# Altium project Banker_VHDCI_2_EDGE _BUF.PrjPCB
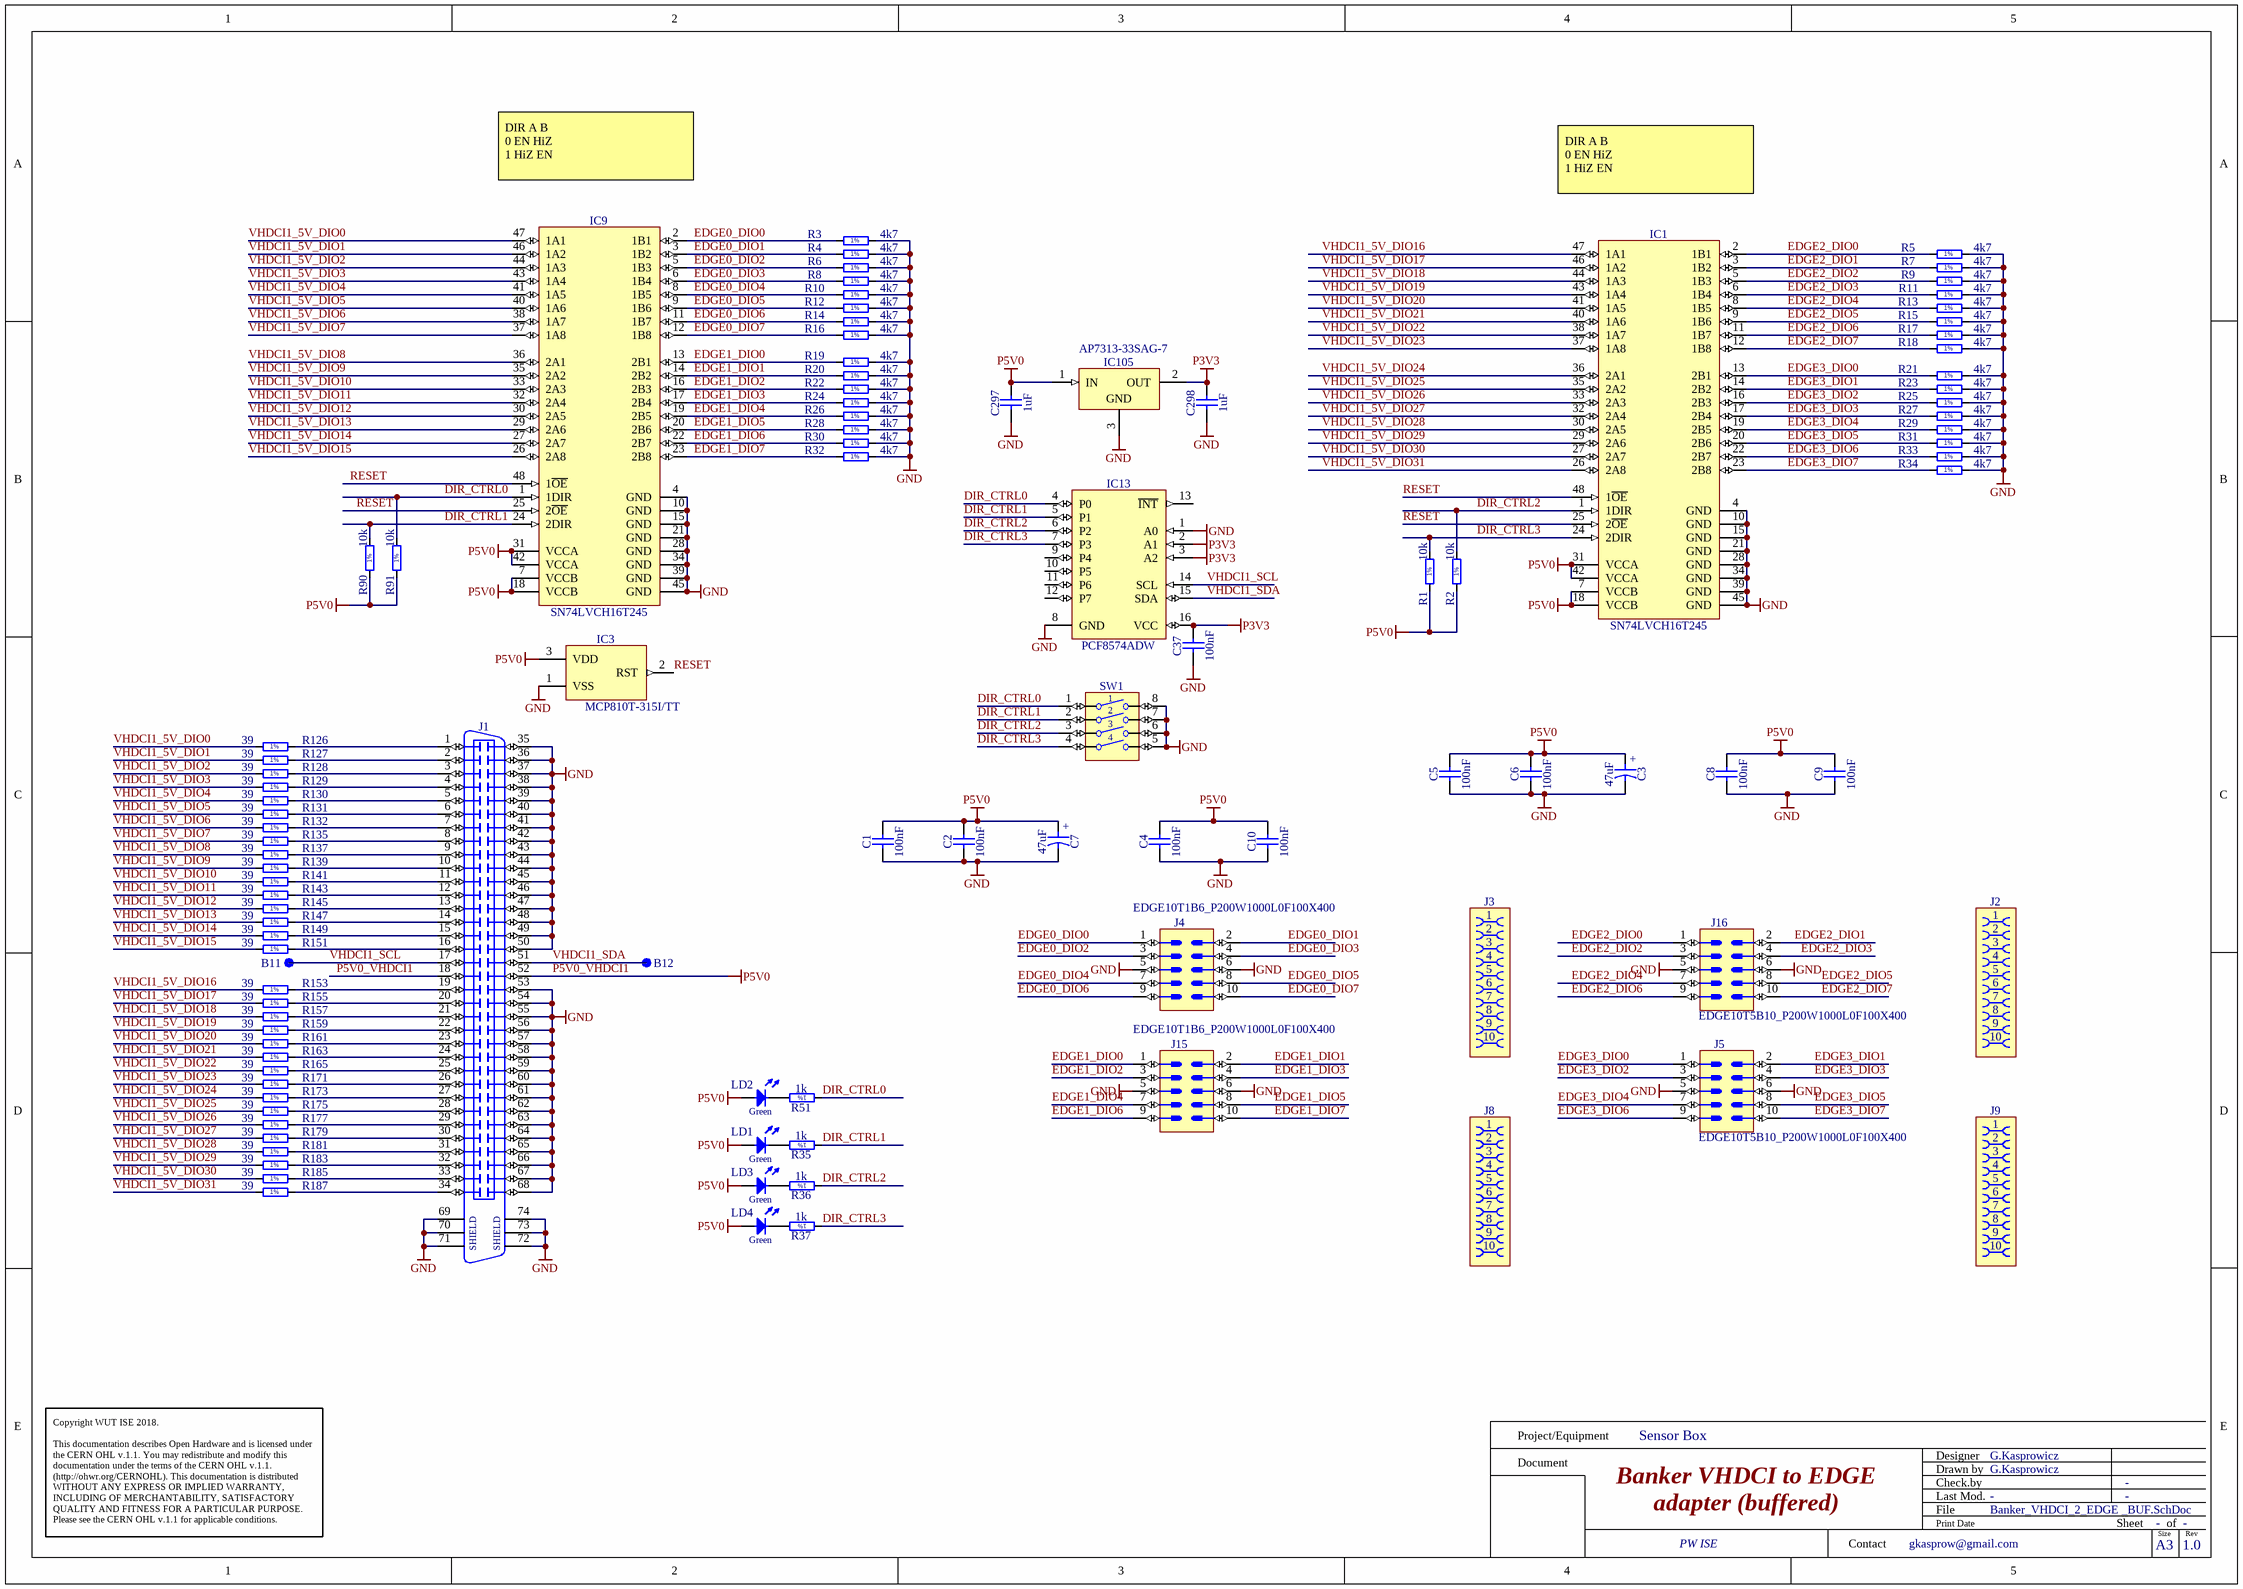
[diagram p0: Banker_VHDCI_2_EDGE _BUF.SchDoc]
1 sheet, 106 parts. Net scope: global (net labels, ports and power ports of the same name join across sheets).
Board file: Banker_VHDCI_2_EDGE _BUF.PCBDOC

## Sheet Banker_VHDCI_2_EDGE _BUF.SchDoc: Banker VHDCI to EDGE
size 420 x 297 mm; Author: G.Kasprowicz; CompanyName: WUT ISE; DrawnBy: G.Kasprowicz; Organization: WUT ISE; Address1: PW ISE; Address2: Nowowiejska 15/19 00-665 Warsaw; Address3: gkasprow@gmail.com; Revision: 1.0; SheetNumber: -; SheetTotal: -; ModifiedBy: -; CheckedDate: -; Title2: adapter (buffered); DivGrp: WUT ISE; Designer: G.Kasprowicz; ModifiedDate: -; ProjectName: Sensor Box

### Parts
B11  SMD Pad  [C100]  (value not drawn)
B12  SMD Pad  [C100]  (value not drawn)
C1  100nF  [CAPC1005X55N]
C2  100nF  [CAPC1005X55N]
C3  47uF  [CAPMP7343X310N]
C4  100nF  [CAPC1005X55N]
C5  100nF  [CAPC1005X55N]
C6  100nF  [CAPC1005X55N]
C7  47uF  [CAPMP7343X310N]
C8  100nF  [CAPC1005X55N]
C9  100nF  [CAPC1005X55N]
C10  100nF  [CAPC1005X55N]
C37  100nF  [CAPC1005X55N]
C297  1uF  [CAPC1005X55N]
C298  1uF  [CAPC1005X55N]
IC1  SN74LVCH16T245  [SOP50P810X120-48N]
IC3  MCP810T-315I/TT  [SOT95P237X112-3N]
IC9  SN74LVCH16T245  [SOP50P810X120-48N]
IC13  PCF8574ADW  [SOIC127P1030X265-16N]
IC105  AP7313-33SAG-7  [SOT95P240X130-3N]
J1  VHDCI  [MOLEX_73776-0201]  (value not drawn)
J2  (no value)  [AVX_00 9159 010 061 916]
J3  (no value)  [AVX_00 9159 010 061 916]
J4  (no value)  [EDGE10T1B6_P200W1000L0F100X400]
J5  (no value)  [EDGE10T5B10_P200W1000L0F100X400]
J8  (no value)  [AVX_00 9159 010 061 916]
J9  (no value)  [AVX_00 9159 010 061 916]
J15  (no value)  [EDGE10T1B6_P200W1000L0F100X400]
J16  (no value)  [EDGE10T5B10_P200W1000L0F100X400]
LD1  Green  [LED_KINGBRIGHT_KPTR3216]  (value not drawn)
LD2  Green  [LED_KINGBRIGHT_KPTR3216]  (value not drawn)
LD3  Green  [LED_KINGBRIGHT_KPTR3216]  (value not drawn)
LD4  Green  [LED_KINGBRIGHT_KPTR3216]  (value not drawn)
R1  10k  [RESC1005X40N]
R2  10k  [RESC1005X40N]
R3  4k7  [RESC1005X40N]
R4  4k7  [RESC1005X40N]
R5  4k7  [RESC1005X40N]
R6  4k7  [RESC1005X40N]
R7  4k7  [RESC1005X40N]
R8  4k7  [RESC1005X40N]
R9  4k7  [RESC1005X40N]
R10  4k7  [RESC1005X40N]
R11  4k7  [RESC1005X40N]
R12  4k7  [RESC1005X40N]
R13  4k7  [RESC1005X40N]
R14  4k7  [RESC1005X40N]
R15  4k7  [RESC1005X40N]
R16  4k7  [RESC1005X40N]
R17  4k7  [RESC1005X40N]
R18  4k7  [RESC1005X40N]
R19  4k7  [RESC1005X40N]
R20  4k7  [RESC1005X40N]
R21  4k7  [RESC1005X40N]
R22  4k7  [RESC1005X40N]
R23  4k7  [RESC1005X40N]
R24  4k7  [RESC1005X40N]
R25  4k7  [RESC1005X40N]
R26  4k7  [RESC1005X40N]
R27  4k7  [RESC1005X40N]
R28  4k7  [RESC1005X40N]
R29  4k7  [RESC1005X40N]
R30  4k7  [RESC1005X40N]
R31  4k7  [RESC1005X40N]
R32  4k7  [RESC1005X40N]
R33  4k7  [RESC1005X40N]
R34  4k7  [RESC1005X40N]
R35  1k  [RESC1005X40N]
R36  1k  [RESC1005X40N]
R37  1k  [RESC1005X40N]
R51  1k  [RESC1005X40N]
R90  10k  [RESC1005X40N]
R91  10k  [RESC1005X40N]
R126  39  [RESC2012X60N]
R127  39  [RESC2012X60N]
R128  39  [RESC2012X60N]
R129  39  [RESC2012X60N]
R130  39  [RESC2012X60N]
R131  39  [RESC2012X60N]
R132  39  [RESC2012X60N]
R135  39  [RESC2012X60N]
R137  39  [RESC2012X60N]
R139  39  [RESC2012X60N]
R141  39  [RESC2012X60N]
R143  39  [RESC2012X60N]
R145  39  [RESC2012X60N]
R147  39  [RESC2012X60N]
R149  39  [RESC2012X60N]
R151  39  [RESC2012X60N]
R153  39  [RESC2012X60N]
R155  39  [RESC2012X60N]
R157  39  [RESC2012X60N]
R159  39  [RESC2012X60N]
R161  39  [RESC2012X60N]
R163  39  [RESC2012X60N]
R165  39  [RESC2012X60N]
R171  39  [RESC2012X60N]
R173  39  [RESC2012X60N]
R175  39  [RESC2012X60N]
R177  39  [RESC2012X60N]
R179  39  [RESC2012X60N]
R181  39  [RESC2012X60N]
R183  39  [RESC2012X60N]
R185  39  [RESC2012X60N]
R187  39  [RESC2012X60N]
SW1  Switch  [SW_OMRON_A6S-4102-H]  (value not drawn)

### Nets
GND: C1.1 C2.1 C3.2 C4.1 C5.1 C6.1 C7.2 C8.1 C9.1 C10.1 C37.1 C297.1 C298.1 IC1.4(GND) IC1.10(GND) IC1.15(GND) IC1.21(GND) IC1.28(GND) IC1.34(GND) IC1.39(GND) IC1.45(GND) IC3.1(VSS) IC9.4(GND) IC9.10(GND) IC9.15(GND) IC9.21(GND) IC9.28(GND) IC9.34(GND) IC9.39(GND) IC9.45(GND) IC13.1(A0) IC13.8(GND) IC105.3(GND) J1.35 J1.36 J1.37 J1.38 J1.39 J1.40 J1.41 J1.42 J1.43 J1.44 J1.45 J1.46 J1.47 J1.48 J1.49 J1.50 J1.53 J1.54 J1.55 J1.56 J1.57 J1.58 J1.59 J1.60 J1.61 J1.62 J1.63 J1.64 J1.65 J1.66 J1.67 J1.68 J1.69 J1.70 J1.71 J1.72 J1.73 J1.74 J4.5 J4.6 J5.5 J5.6 J15.5 J15.6 J16.5 J16.6 R3.2 R4.2 R5.2 R6.2 R7.2 R8.2 R9.2 R10.2 R11.2 R12.2 R13.2 R14.2 R15.2 R16.2 R17.2 R18.2 R19.2 R20.2 R21.2 R22.2 R23.2 R24.2 R25.2 R26.2 R27.2 R28.2 R29.2 R30.2 R31.2 R32.2 R33.2 R34.2 SW1.5 SW1.6 SW1.7 SW1.8
P3V3: C37.2 C298.2 IC13.2(A1) IC13.3(A2) IC13.16(VCC) IC105.2(OUT)
P5V0_VHDCI1: C1.2 C2.2 C3.1 C4.2 C5.2 C6.2 C7.1 C8.2 C9.2 C10.2 C297.2 IC1.7(VCCB) IC1.18(VCCB) IC1.31(VCCA) IC1.42(VCCA) IC3.3(VDD) IC9.7(VCCB) IC9.18(VCCB) IC9.31(VCCA) IC9.42(VCCA) IC105.1(IN) J1.18 J1.52 LD1.2(A) LD2.2(A) LD3.2(A) LD4.2(A) R1.1 R2.1 R90.1 R91.1  [also labelled P5V0]
DIR_CTRL0: IC9.1(1DIR) IC13.4(P0) R51.1 R91.2 SW1.1
DIR_CTRL1: IC9.24(2DIR) IC13.5(P1) R35.1 R90.2 SW1.2
DIR_CTRL2: IC1.1(1DIR) IC13.6(P2) R2.2 R36.1 SW1.3
DIR_CTRL3: IC1.24(2DIR) IC13.7(P3) R1.2 R37.1 SW1.4
EDGE0_DIO0: IC9.2(1B1) J4.1 R3.1
EDGE0_DIO1: IC9.3(1B2) J4.2 R4.1
EDGE0_DIO2: IC9.5(1B3) J4.3 R6.1
EDGE0_DIO3: IC9.6(1B4) J4.4 R8.1
EDGE0_DIO4: IC9.8(1B5) J4.7 R10.1
EDGE0_DIO5: IC9.9(1B6) J4.8 R12.1
EDGE0_DIO6: IC9.11(1B7) J4.9 R14.1
EDGE0_DIO7: IC9.12(1B8) J4.10 R16.1
EDGE1_DIO0: IC9.13(2B1) J15.1 R19.1
EDGE1_DIO1: IC9.14(2B2) J15.2 R20.1
EDGE1_DIO2: IC9.16(2B3) J15.3 R22.1
EDGE1_DIO3: IC9.17(2B4) J15.4 R24.1
EDGE1_DIO4: IC9.19(2B5) J15.7 R26.1
EDGE1_DIO5: IC9.20(2B6) J15.8 R28.1
EDGE1_DIO6: IC9.22(2B7) J15.9 R30.1
EDGE1_DIO7: IC9.23(2B8) J15.10 R32.1
EDGE2_DIO0: IC1.2(1B1) J16.1 R5.1
EDGE2_DIO1: IC1.3(1B2) J16.2 R7.1
EDGE2_DIO2: IC1.5(1B3) J16.3 R9.1
EDGE2_DIO3: IC1.6(1B4) J16.4 R11.1
EDGE2_DIO4: IC1.8(1B5) J16.7 R13.1
EDGE2_DIO5: IC1.9(1B6) J16.8 R15.1
EDGE2_DIO6: IC1.11(1B7) J16.9 R17.1
EDGE2_DIO7: IC1.12(1B8) J16.10 R18.1
EDGE3_DIO0: IC1.13(2B1) J5.1 R21.1
EDGE3_DIO1: IC1.14(2B2) J5.2 R23.1
EDGE3_DIO2: IC1.16(2B3) J5.3 R25.1
EDGE3_DIO3: IC1.17(2B4) J5.4 R27.1
EDGE3_DIO4: IC1.19(2B5) J5.7 R29.1
EDGE3_DIO5: IC1.20(2B6) J5.8 R31.1
EDGE3_DIO6: IC1.22(2B7) J5.9 R33.1
EDGE3_DIO7: IC1.23(2B8) J5.10 R34.1
RESET: IC1.25(2~{OE}) IC1.48(1~{OE}) IC3.2(RST) IC9.25(2~{OE}) IC9.48(1~{OE})
VHDCI1_5V_DIO0: IC9.47(1A1) R126.1
VHDCI1_5V_DIO1: IC9.46(1A2) R127.1
VHDCI1_5V_DIO2: IC9.44(1A3) R128.1
VHDCI1_5V_DIO3: IC9.43(1A4) R129.1
VHDCI1_5V_DIO4: IC9.41(1A5) R130.1
VHDCI1_5V_DIO5: IC9.40(1A6) R131.1
VHDCI1_5V_DIO6: IC9.38(1A7) R132.1
VHDCI1_5V_DIO7: IC9.37(1A8) R135.1
VHDCI1_5V_DIO8: IC9.36(2A1) R137.1
VHDCI1_5V_DIO9: IC9.35(2A2) R139.1
VHDCI1_5V_DIO10: IC9.33(2A3) R141.1
VHDCI1_5V_DIO11: IC9.32(2A4) R143.1
VHDCI1_5V_DIO12: IC9.30(2A5) R145.1
VHDCI1_5V_DIO13: IC9.29(2A6) R147.1
VHDCI1_5V_DIO14: IC9.27(2A7) R149.1
VHDCI1_5V_DIO15: IC9.26(2A8) R151.1
VHDCI1_5V_DIO16: IC1.47(1A1) R153.1
VHDCI1_5V_DIO17: IC1.46(1A2) R155.1
VHDCI1_5V_DIO18: IC1.44(1A3) R157.1
VHDCI1_5V_DIO19: IC1.43(1A4) R159.1
VHDCI1_5V_DIO20: IC1.41(1A5) R161.1
VHDCI1_5V_DIO21: IC1.40(1A6) R163.1
VHDCI1_5V_DIO22: IC1.38(1A7) R165.1
VHDCI1_5V_DIO23: IC1.37(1A8) R171.1
VHDCI1_5V_DIO24: IC1.36(2A1) R173.1
VHDCI1_5V_DIO25: IC1.35(2A2) R175.1
VHDCI1_5V_DIO26: IC1.33(2A3) R177.1
VHDCI1_5V_DIO27: IC1.32(2A4) R179.1
VHDCI1_5V_DIO28: IC1.30(2A5) R181.1
VHDCI1_5V_DIO29: IC1.29(2A6) R183.1
VHDCI1_5V_DIO30: IC1.27(2A7) R185.1
VHDCI1_5V_DIO31: IC1.26(2A8) R187.1
VHDCI1_SCL: B11.1 IC13.14(SCL) J1.17
VHDCI1_SDA: B12.1 IC13.15(SDA) J1.51
NetJ1_1: J1.1 R126.2
NetJ1_2: J1.2 R127.2
NetJ1_3: J1.3 R128.2
NetJ1_4: J1.4 R129.2
NetJ1_5: J1.5 R130.2
NetJ1_6: J1.6 R131.2
NetJ1_7: J1.7 R132.2
NetJ1_8: J1.8 R135.2
NetJ1_9: J1.9 R137.2
NetJ1_10: J1.10 R139.2
NetJ1_11: J1.11 R141.2
NetJ1_12: J1.12 R143.2
NetJ1_13: J1.13 R145.2
NetJ1_14: J1.14 R147.2
NetJ1_15: J1.15 R149.2
NetJ1_16: J1.16 R151.2
NetJ1_19: J1.19 R153.2
NetJ1_20: J1.20 R155.2
NetJ1_21: J1.21 R157.2
NetJ1_22: J1.22 R159.2
NetJ1_23: J1.23 R161.2
NetJ1_24: J1.24 R163.2
NetJ1_25: J1.25 R165.2
NetJ1_26: J1.26 R171.2
NetJ1_27: J1.27 R173.2
NetJ1_28: J1.28 R175.2
NetJ1_29: J1.29 R177.2
NetJ1_30: J1.30 R179.2
NetJ1_31: J1.31 R181.2
NetJ1_32: J1.32 R183.2
NetJ1_33: J1.33 R185.2
NetJ1_34: J1.34 R187.2
NetLD1_1: LD1.1(C) R35.2
NetLD2_1: LD2.1(C) R51.2
NetLD3_1: LD3.1(C) R36.2
NetLD4_1: LD4.1(C) R37.2

Not connected (* = marked no-connect by the designer): IC13 9(P4) 10(P5) 11(P6) 12(P7) 13(~{INT})

### Notes on the sheet
- DIR	A	B
  0	EN	HiZ
  1	HiZ	EN
- Project/Equipment
- Document
- Designer
- Drawn by
- Check.by
- Copyright WUT ISE 2018.
  This documentation describes Open Hardware and is licensed under the CERN OHL v.1.1. You may redistribute and modify this documentation under the terms of the CERN OHL v.1.1. (http://ohwr.org/CERNOHL). This documentation is distributed WITHOUT ANY EXPRESS OR IMPLIED WARRANTY, INCLUDING OF MERCHANTABILITY, SATISFACTORY QUALITY AND FITNESS FOR A PARTICULAR PURPOSE. Please see the CERN OHL v.1.1 for applicable conditions.
- Contact
- File
- Last Mod.
- Print Date
- Sheet
- Size
- A3
- of
- Rev
- (in symbol CTE7343-31_47UF_25V_10%) +
- (in symbol MOLEX_73776-0201) SHIELD
- (in symbol R0402_1K_1%_0.0625W_100PPM) 1%
- (in symbol R0402_4K7_1%_0.0625W_100PPM) 1%
- (in symbol R0402_10K_1%_0.0625W_100PPM) 1%
- (in symbol R0805_39R_1%_0.125W_100PPM) 1%

### Library data of the parts
B11 B12 = SMD_PAD_D1MM: Through Hole Pad; Part Description: 1mm Diameter SMD Pad; Mounted: No; Part Number: SMD_PAD_D1MM; Component Kind: Standard (No BOM); Component Type: Standard (No BOM); Pin Count: 1; Family: SMD Pad; Socket: No; SMD: No; Sense: No; Status: None; ComponentHeight: 0mm; HelpURL: Undefined; Author: CERN DEM JLC; CreateDate: 10.10.2017; LatestRevisionDate: 10.10.2017; PackageDescription: 1mm Diameter SMD Pad
C1 C2 C4-C6 C8-C10 C37 = CC0402_100NF_16V_10%_X5R: Non-polarised capacitor; Part Description: SMD Multilayer Chip Ceramic Capacitor; Manufacturer: GENERIC; Manufacturer1 Part Number: GRM155R61C104KA88D; Voltage: 16V; TC: X5R; Tolerance: ±10%; Part Number: CC0402_100NF_16V_10%_X5R; Component Kind: Standard; Component Type: Standard; Pin Count: 2; Value: 100nF; Status: None; Manufacturer Part Number: CC0402_100NF_16V_10%_X5R; Case: 0402; Mounted: Yes; Socket: No; SMD: Yes; Sense: No; Manufacturer1 Example: MURATA; Manufacturer1 ComponentHeight: 0.55mm; HelpURL: \\cern.ch\dfs\Applications\Altium\Datasheets\CC0402_X5R_MURATA_GRM.pdf; Author: CERN DEM JLC; CreateDate: 10.12.2013; LatestRevisionDate: 10.12.2013
C3 C7 = CTE7343-31_47UF_25V_10%: Polarised capacitor; Part Description: Solid Tantalum Chip Capacitor; Manufacturer: GENERIC; Manufacturer1 Part Number: TAJD476K025R; Voltage: 25V; Tolerance: ±10%; Part Number: CTE7343-31_47UF_25V_10%; Component Kind: Standard; Component Type: Standard; Pin Count: 2; Value: 47uF; Status: Preferred; Manufacturer Part Number: CTE7343-31_47UF_25V_10%; Case: D; Mounted: Yes; Socket: No; SMD: Yes; Sense: No; Manufacturer1 Example: AVX; Manufacturer1 ComponentHeight: 3.1mm; HelpURL: \\cern.ch\dfs\Applications\Altium\Datasheets\CTE_AVX_TAJ.pdf; Author: CERN DEM JLC; CreateDate: 03/12/2007; LatestRevisionDate: 03/12/2007
C297 C298 = CC0402_1UF_16V_10%_X5R: Non-polarised capacitor; Part Description: SMD Multilayer Chip Ceramic Capacitor; Manufacturer: GENERIC; Manufacturer1 Part Number: C1005X5R1C105KT; Voltage: 16V; TC: X5R; Tolerance: ±10%; Part Number: CC0402_1UF_16V_10%_X5R; Component Kind: Standard; Component Type: Standard; Pin Count: 2; Value: 1uF; Status: Preferred; Manufacturer Part Number: CC0402_1UF_16V_10%_X5R; Case: 0402; Mounted: Yes; Socket: No; SMD: Yes; Sense: No; Manufacturer1 Example: TDK; Manufacturer1 ComponentHeight: 0.55mm; HelpURL: \\cern.ch\dfs\Applications\Altium\Datasheets\CC0402_X5R_TDK_C.pdf; Author: CERN DEM JLC; CreateDate: 25.10.2012; LatestRevisionDate: 25.10.2012
IC1 IC9 = 74LVCH16T245: 16-Bit Dual-Supply Bus Transceiver With Configurable Voltage Translation And 3-State Outputs; Part Number: SN74LVCH16T245DGGR; Part Description: 16-Bit Dual-Supply Bus Transceivers With Configurable Voltage Translation And 3-State Outputs; Manufacturer: TEXAS INSTRUMENTS; PressFit: No; Bonding: No; Component Kind: Standard; Component Type: Standard; Device: SN74LVCH16T245; PackageDescription: SOP, 48-Leads, Body 12.6x6.2mm (max), Pitch 0.50mm, IPC Medium Density; Manufacturer Part Number: SN74LVCH16T245DGGR; Pin Count: 48; Case: TSSOP48; Mounted: Yes; Socket: No; SMD: Yes; Sense: No; ComponentHeight: 1.2mm; Author: GK; HelpURL: \\cern.ch\dfs\Applications\Altium\Datasheets\CLVCH16T245MDGGREP.pdf; CreateDate: 09/02/2016; LatestRevisionDate: 09/02/2016
IC3 = VMON_MCP810: 3.075V Microcontroller Supervisory Circuit With Push-Pull Output; Manufacturer: MICROCHIP TECHNOLOGY; PressFit: No; Bonding: No; Part Number: MCP810T-315I/TT; Component Kind: Standard; Component Type: Standard; Device: MCP810T-315I/TT; PackageDescription: SOT, 0.95mm, pitch; 3 pin,1.30mm W X 2.92mm L X 1.12mm H body, IPC Medium Density; Part Description: 3.075V Microcontroller Supervisory Circuit With Push-Pull Output; Manufacturer Part Number: MCP810T-315I/TT; Pin Count: 3; Case: SOT23; Mounted: Yes; Socket: No; SMD: Yes; Sense: No; ComponentHeight: 1.12mm; Author: GK; HelpURL: \\cern.ch\dfs\Applications\Altium\Datasheets\MCP809T-315I-TT.pdf; CreateDate: 16.06.2011; LatestRevisionDate: 16.06.2011
IC13 = PCF8574ADW: Remote 8-bit I/O Expander For I2C Bus; Manufacturer: TEXAS INSTRUMENTS; PressFit: No; Bonding: No; Part Number: PCF8574ADW; Component Kind: Standard; Component Type: Standard; Device: PCF8574ADW; PackageDescription: SOIC 16, Pitch 1.27mm - Body 7.5x10.3mm, IPC Medium Density; Part Description: Remote 8-bit I/O Expander For I2C Bus; Manufacturer Part Number: PCF8574ADW; Pin Count: 16; Case: SOIC16W; Mounted: Yes; Socket: No; SMD: Yes; Sense: No; ComponentHeight: 2.65mm; Author: CERN DEM JLC; HelpURL: \\cern.ch\dfs\Applications\Altium\Datasheets\PCF8574ADW.pdf; CreateDate: 01.11.2012; LatestRevisionDate: 01.11.2012
IC105 = AP7313-33SAG-7: 3-Terminal Regulator 1=IN 2=OUT 3=GND; Part Description: 3.3V, 150mA Low Quiescent Current, Fast Transient Low Dropout Linear Regulator; Manufacturer: DIODES INCORPORATED; PressFit: No; Bonding: No; Part Number: AP7313-33SAG-7; Component Kind: Standard; Component Type: Standard; Device: AP7313-33SAG-7; PackageDescription: SOT23 3-Leads, Pitch 0.95mm - Body 1.3x2.9mm, IPC Medium Density; Manufacturer Part Number: AP7313-33SAG-7; Pin Count: 3; Case: SOT23; Mounted: Yes; Socket: No; SMD: Yes; Sense: No; ComponentHeight: 1.35mm; HelpURL: \\cern.ch\dfs\Applications\Altium\Datasheets\AP7313-33SAG-7.pdf; Author: CERN DEM JLC; CreateDate: 20.03.2018; LatestRevisionDate: 20.03.2018
J1 = MOLEX_73776-0201: 0.80mm Pitch, 68 Contacts, Ultra+ VHDCI Surface Mount Vertical Receptacle; Part Description: 0.80mm Pitch, 68 Contacts, Ultra+ VHDCI Surface Mount Vertical Receptacle With Screwlock Kit; Manufacturer: MOLEX; PressFit: No; Part Number: MOLEX_73776-0201; Component Kind: Standard; Component Type: Standard; Pin Count: 74; Family: VHDCI; Mounted: Yes; Socket: No; SMD: Yes; Sense: No; Status: None; Manufacturer Part Number: 73776-0201; ComponentHeight: 10.7mm; HelpURL: \\cern.ch\dfs\Applications\Altium\Datasheets\MOLEX_73776-0201.pdf; Author: CERN DEM JLC; CreateDate: 14/01/2013; LatestRevisionDate: 14/01/2013
J2 J3 J8 J9 = AVX_00 9159 010 061 916: Open Ended Card Edge Connector, 9159 Series; Part Description: 10 Contacts, 2mm Pitch, Open Ended Card Edge Connector, 9159 Series; Manufacturer: AVX; PressFit: No; Part Number: AVX_00 9159 010 061 916; Component Kind: Standard; Component Type: Standard; Pin Count: 10; Mounted: Yes; Socket: No; SMD: No; Sense: No; Status: None; Manufacturer Part Number: 00 9159 010 061 916; ComponentHeight: 1.6mm; HelpURL: \\cern.ch\dfs\Applications\Altium\Datasheets\AVX_00 9159 010 061 916.pdf; Author: CERN DEM MR; CreateDate: 13.02.2018; LatestRevisionDate: 13.02.2018
J4 J15 = EDGE10T1B6_P200W1000L0F100X400: PCB Edge Connector 10 (2x5); Part Description: 10 Contacts Board Edge Connector, Pitch 2mm, Length 0mm, Width 10mm, Finger Lenght 4mm, Finger Width 1mm; Mounted: No; PressFit: No; Part Number: EDGE10T1B6_P200W1000L0F100X400; Component Kind: Standard (No BOM); Component Type: Standard (No BOM); Pin Count: 10; Socket: No; SMD: No; Sense: No; Status: None; ComponentHeight: 0mm; HelpURL: \\cern.ch\dfs\Applications\Altium\Datasheets\EDGE10T1B6_P200W1000L0F100X400.pdf; Author: CERN DEM MR; CreateDate: 14.02.2018; LatestRevisionDate: 14.02.2018
J5 J16 = EDGE10T5B10_P200W1000L0F100X400: PCB Edge Connector 10 (2x5); Part Description: 10 Contacts Board Edge Connector, Pitch 2mm, Length 0mm, Width 10mm, Finger Lenght 4mm, Finger Width 1mm; Mounted: No; PressFit: No; Part Number: EDGE10T5B10_P200W1000L0F100X400; Component Kind: Standard (No BOM); Component Type: Standard (No BOM); Pin Count: 10; Socket: No; SMD: No; Sense: No; Status: None; ComponentHeight: 0mm; HelpURL: \\cern.ch\dfs\Applications\Altium\Datasheets\EDGE10T5B10_P200W1000L0F100X400.pdf; Author: CERN DEM MR; CreateDate: 14.02.2018; LatestRevisionDate: 14.02.2018
LD1-LD4 = LED_KINGBRIGHT_KPTR-3216CGCK: LED Green 1A 2C; Part Description: Reverse Mount LED 1.4x1.6mm Green; PressFit: No; Bonding: No; Part Number: LED_KINGBRIGHT_KPTR-3216CGCK; Component Kind: Standard; Component Type: Standard; Color: Green; PackageDescription: Reverse Mount LED 3216, Hole 2.1x2.3mm 0.35mm Height; Manufacturer: KINGBRIGHT; Manufacturer Part Number: KPTR-3216CGCK; Pin Count: 2; Mounted: Yes; Socket: No; SMD: Yes; Sense: No; ComponentHeight: 0.35mm; HelpURL: \\cern.ch\dfs\Applications\Altium\Datasheets\LED_KINGBRIGHT_KPTR-3216CGCK.pdf; Author: CERN DEM MR; CreateDate: 15.02.2016; LatestRevisionDate: 15.02.2016
R1 R2 R90 R91 = R0402_10K_1%_0.0625W_100PPM: Resistor - 1%; Part Description: General Purpose Thick Film Chip Resistor; Manufacturer: GENERIC; Manufacturer1 Part Number: 232270671003L; TC: ±100ppm/°C; PressFit: No; Part Number: R0402_10K_1%_0.0625W_100PPM; Component Kind: Standard; Component Type: Standard; Pin Count: 2; Value: 10k; Status: Not Recommended; Power: 0.0625W; Tolerance: ±1%; Manufacturer Part Number: R0402_10K_1%_0.0625W_100PPM; Case: 0402; Mounted: Yes; Sense: No; Socket: No; SMD: Yes; Manufacturer1 Example: YAGEO PHYCOMP; Manufacturer1 ComponentHeight: 0.4mm; HelpURL: \\cern.ch\dfs\Applications\Altium\Datasheets\R0402_Phycomp_RC0402.pdf; Author: CERN DEM JLC; CreateDate: 03/12/2007; LatestRevisionDate: 17/10/2012
R3-R34 = R0402_4K7_1%_0.0625W_100PPM: Resistor - 1%; Part Description: General Purpose Thick Film Chip Resistor; Manufacturer: GENERIC; Manufacturer1 Part Number: 232270674702L; TC: ±100ppm/°C; PressFit: No; Part Number: R0402_4K7_1%_0.0625W_100PPM; Component Kind: Standard; Component Type: Standard; Pin Count: 2; Value: 4k7; Status: Not Recommended; Power: 0.0625W; Tolerance: ±1%; Manufacturer Part Number: R0402_4K7_1%_0.0625W_100PPM; Case: 0402; Mounted: Yes; Sense: No; Socket: No; SMD: Yes; Manufacturer1 Example: YAGEO PHYCOMP; Manufacturer1 ComponentHeight: 0.4mm; HelpURL: \\cern.ch\dfs\Applications\Altium\Datasheets\R0402_Phycomp_RC0402.pdf; Author: CERN DEM JLC; CreateDate: 03/12/2007; LatestRevisionDate: 17/10/2012
R35-R37 R51 = R0402_1K_1%_0.0625W_100PPM: Resistor - 1%; Part Description: General Purpose Thick Film Chip Resistor; Manufacturer: GENERIC; Manufacturer1 Part Number: 232270671002L; TC: ±100ppm/°C; PressFit: No; Part Number: R0402_1K_1%_0.0625W_100PPM; Component Kind: Standard; Component Type: Standard; Pin Count: 2; Value: 1k; Status: Not Recommended; Power: 0.0625W; Tolerance: ±1%; Manufacturer Part Number: R0402_1K_1%_0.0625W_100PPM; Case: 0402; Mounted: Yes; Sense: No; Socket: No; SMD: Yes; Manufacturer1 Example: YAGEO PHYCOMP; Manufacturer1 ComponentHeight: 0.4mm; HelpURL: \\cern.ch\dfs\Applications\Altium\Datasheets\R0402_Phycomp_RC0402.pdf; Author: CERN DEM JLC; CreateDate: 03.12.2007; LatestRevisionDate: 17.10.2012
R126-R132 R135 R137 R139 R141 R143 R145 R147 R149 R151 R153 R155 R157 R159 R161 R163 R165 R171 R173 R175 R177 R179 R181 R183 R185 R187 = R0805_39R_1%_0.125W_100PPM: Resistor - 1%; Part Description: General Purpose Thick Film Chip Resistor; Manufacturer: GENERIC; Manufacturer1 Part Number: NRC10F39R0TRF; Power: 0.125W; TC: ±100ppm/°C; PressFit: No; Part Number: R0805_39R_1%_0.125W_100PPM; Component Kind: Standard; Component Type: Standard; Pin Count: 2; Value: 39; Status: Preferred; Tolerance: ±1%; Manufacturer Part Number: R0805_39R_1%_0.125W_100PPM; Case: 0805; Mounted: Yes; Sense: No; Socket: No; SMD: Yes; Manufacturer1 Example: NIC COMPONENT; Manufacturer1 ComponentHeight: 0.6mm; HelpURL: \\cern.ch\dfs\Applications\Altium\Datasheets\R0805_NIC_NRC.pdf; Author: CERN DEM JLC; CreateDate: 03/12/2007; LatestRevisionDate: 13/03/2008
SW1 = SW_OMRON_A6S-4102-H: 4 Ways SPST DIP Switch; Part Description: 4 Ways SPST DIP Switch, White Flat Actuator with Seal Tape, Contact Rating 25mA 24VDC; Manufacturer: OMRON; PressFit: No; Part Number: SW_OMRON_A6S-4102-H; Component Kind: Standard; Component Type: Standard; Pin Count: 8; PackageDescription: Pitch 2.54mm, Body 11.3x6.4mm, 4 Ways SPST Surface-Mounting DIP Switch, OMRON A6S-H; Family: Switch; Mounted: Yes; Socket: No; SMD: Yes; Sense: No; Status: None; Manufacturer Part Number: A6S-4102-H; ComponentHeight: 3.8mm; HelpURL: \\cern.ch\dfs\Applications\Altium\Datasheets\SW_OMRON_A6S-4102-H.pdf; Author: CERN DEM JMW; CreateDate: 25/09/2008; LatestRevisionDate: 25/09/2008

## Assembly variants
SMD_DCDC: not fitted IC46 IC53